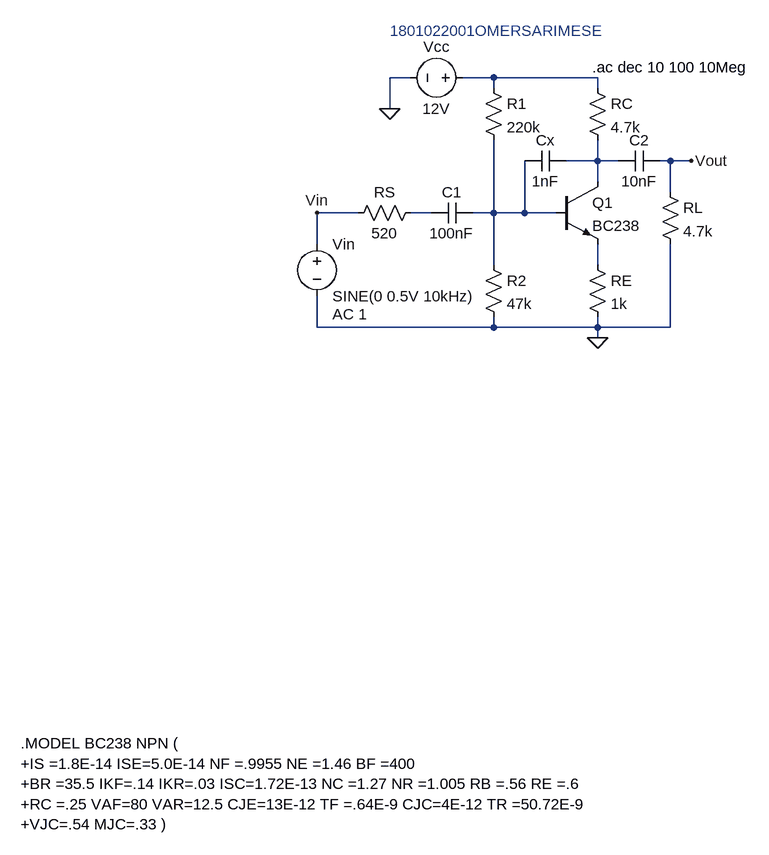
[diagram p0: schematic common_emitter_amp.asc]
common_emitter_amp.asc, the LTspice schematic file:
Version 4
SHEET 1 880 1140
WIRE -64 -32 -96 -32
WIRE 64 -32 16 -32
WIRE 224 -32 64 -32
WIRE 64 -16 64 -32
WIRE 224 -16 224 -32
WIRE -96 16 -96 -32
WIRE 224 96 224 64
WIRE 224 96 176 96
WIRE 256 96 224 96
WIRE 336 96 320 96
WIRE 368 96 336 96
WIRE 224 128 224 96
WIRE 336 144 336 96
WIRE -144 176 -208 176
WIRE -32 176 -64 176
WIRE 64 176 64 64
WIRE 64 176 32 176
WIRE 112 176 112 96
WIRE 112 176 64 176
WIRE 160 176 112 176
WIRE -208 224 -208 176
WIRE 64 256 64 176
WIRE 224 256 224 224
WIRE -208 352 -208 304
WIRE 64 352 64 336
WIRE 64 352 -208 352
WIRE 224 352 224 336
WIRE 224 352 64 352
WIRE 336 352 336 224
WIRE 336 352 224 352
WIRE 224 368 224 352
FLAG 224 368 0
FLAG -96 16 0
FLAG 368 96 Vout
FLAG -208 176 Vin
SYMBOL npn 160 128 R0
SYMATTR InstName Q1
SYMATTR Value BC238
SYMBOL res 208 -32 R0
SYMATTR InstName RC
SYMATTR Value 4.7k
SYMBOL res 48 -32 R0
SYMATTR InstName R1
SYMATTR Value 220k
SYMBOL res 48 240 R0
SYMATTR InstName R2
SYMATTR Value 47k
SYMBOL res 208 240 R0
SYMATTR InstName RE
SYMATTR Value 1k
SYMBOL cap 176 80 R90
WINDOW 0 0 32 VBottom 2
WINDOW 3 32 32 VTop 2
SYMATTR InstName Cx
SYMATTR Value 1nF
SYMBOL voltage -208 208 R0
WINDOW 123 24 124 Left 2
WINDOW 39 0 0 Left 0
SYMATTR Value2 AC 1
SYMATTR InstName Vin
SYMATTR Value SINE(0 0.5V 10kHz)
SYMBOL res -48 160 R90
WINDOW 0 0 56 VBottom 2
WINDOW 3 32 56 VTop 2
SYMATTR InstName RS
SYMATTR Value 520
SYMBOL cap 32 160 R90
WINDOW 0 0 32 VBottom 2
WINDOW 3 32 32 VTop 2
SYMATTR InstName C1
SYMATTR Value 100nF
SYMBOL res 320 128 R0
SYMATTR InstName RL
SYMATTR Value 4.7k
SYMBOL cap 320 80 R90
WINDOW 0 0 32 VBottom 2
WINDOW 3 32 32 VTop 2
SYMATTR InstName C2
SYMATTR Value 10nF
SYMBOL voltage 32 -32 R90
WINDOW 0 -32 56 VBottom 2
WINDOW 3 32 56 VTop 2
WINDOW 123 0 0 Left 0
WINDOW 39 0 0 Left 0
SYMATTR InstName Vcc
SYMATTR Value 12V
TEXT -664 992 Left 2 !.MODEL BC238 NPN (\n+IS =1.8E-14 ISE=5.0E-14 NF =.9955 NE =1.46 BF =400\n+BR =35.5 IKF=.14 IKR=.03 ISC=1.72E-13 NC =1.27 NR =1.005 RB =.56 RE =.6\n+RC =.25 VAF=80 VAR=12.5 CJE=13E-12 TF =.64E-9 CJC=4E-12 TR =50.72E-9\n+VJC=.54 MJC=.33 )
TEXT -96 -104 Left 2 ;1801022001OMERSARIMESE
TEXT 216 -48 Left 2 !.ac dec 10 100 10Meg

The netlist it stands for:
* common_emitter_amp.asc
Q1 N002 N004 N005 0 BC238
RC N001 N002 4.7k
R1 N001 N004 220k
R2 N004 0 47k
RE N005 0 1k
Cx N002 N004 1nF
Vin Vin 0 SINE(0 0.5V 10kHz) AC 1
RS N003 Vin 520
C1 N004 N003 100nF
RL Vout 0 4.7k
C2 Vout N002 10nF
Vcc N001 0 12V
.model NPN NPN
.model PNP PNP
.lib standard.bjt
.MODEL BC238 NPN (
+IS =1.8E-14 ISE=5.0E-14 NF =.9955 NE =1.46 BF =400
+BR =35.5 IKF=.14 IKR=.03 ISC=1.72E-13 NC =1.27 NR =1.005 RB =.56 RE =.6
+RC =.25 VAF=80 VAR=12.5 CJE=13E-12 TF =.64E-9 CJC=4E-12 TR =50.72E-9
+VJC=.54 MJC=.33 )
* 1801022001OMERSARIMESE
.ac dec 10 100 10Meg
.backanno
.end